# Altium schematic sheet ESP32.SchDoc
size A3 portrait
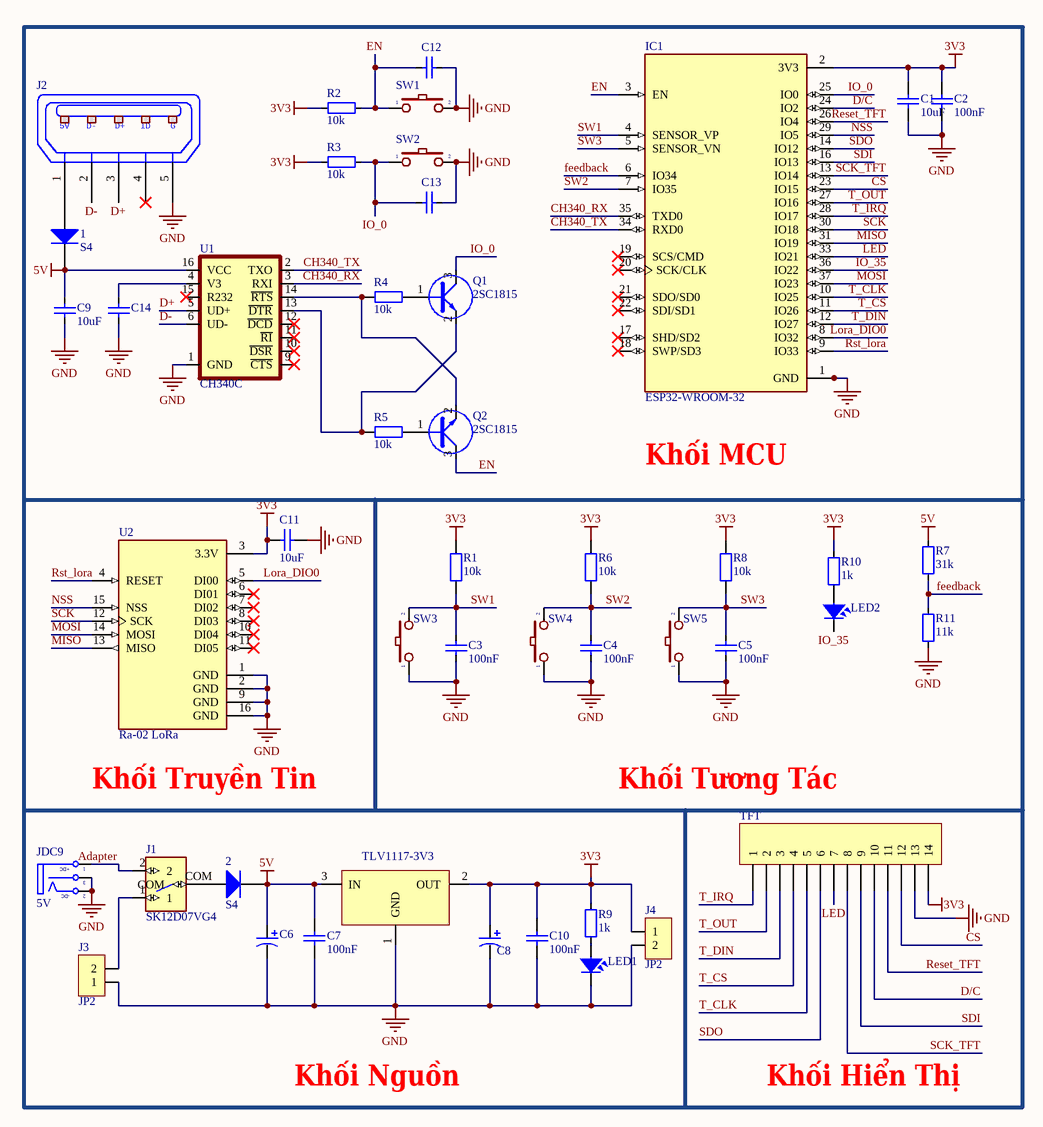
[diagram p0: ESP32.SchDoc]

## Parts
1  S4  [DIO-214AC(SMA)]
2  S4  [DIO-214AC(SMA)]
C1  10uF  [CAP_0805]
C2  100nF  [CAP_0805]
C3  100nF  [CAP_0805]
C4  100nF  [CAP_0805]
C5  100nF  [CAP_0805]
C6  22uF/10V  [CAP_7343]  (value not drawn)
C7  100nF  [CAP_0805]
C8  22uF/10V  [CAP_7343]  (value not drawn)
C9  10uF  [CAP_0805]
C10  100nF  [CAP_0805]
C11  10uF  [CAP_0805]
C12  100nF  [CAP_0805]  (value not drawn)
C13  100nF  [CAP_0805]  (value not drawn)
C14  100nF  [CAP_0805]  (value not drawn)
IC1  ESP32-WROOM-32  [MODULE_ESP32-WROOM-32]
J1  SK12D07VG4  [SK12D07VG4]
J2  USB-5  [USB-M1]  (value not drawn)
J3  JP2  [JP2-C1T]
J4  JP2  [JP2-C1T]
JDC9  5V  [DC-IN]
LED1  LED  [LED-0805-Blue]  (value not drawn)
LED2  LED  [LED-0805-Blue]  (value not drawn)
Power1  TLV1117-3V3  [SOT230P700X180-4N]
Q1  2SC1815  [SOT23D]
Q2  2SC1815  [SOT23D]
R1  10k  [RES_SMD_0805]
R2  10k  [RES-SMD-0805]
R3  10k  [RES-SMD-0805]
R4  10k  [RES-SMD-0805]
R5  10k  [RES-SMD-0805]
R6  10k  [RES_SMD_0805]
R7  31k  [RES-SMD-0805]
R8  10k  [RES_SMD_0805]
R9  1k  [RES-SMD-0805]
R10  1k  [RES-SMD-0805]
R11  11k  [RES-SMD-0805]
SW1  SW  [SW 3x2x4]  (value not drawn)
SW2  SW  [SW 3x2x4]  (value not drawn)
SW3  SW  [SW-SMD]  (value not drawn)
SW4  SW  [SW-SMD]  (value not drawn)
SW5  SW  [SW-SMD]  (value not drawn)
TFT  JP14  [JP14-D1T]  (value not drawn)
U1  CH340C  [SOP-16]
U2  Ra-02 LoRa  [Ra-02]

## Nets
3V3: C1.1 C2.1 C8.1 C10.1 C11.1 IC1.2(3V3) J4.1 Power1.2(OUT) R1.1 R2.2 R3.2 R6.1 R8.1 R9.1 R10.1 TFT.14 U2.3(3.3V)
5V: 1.2(K) 2.2(K) C6.1 C7.1 C9.2 Power1.3(IN) R7.1 U1.16(VCC)
GND: C1.2 C2.2 C3.2 C4.2 C5.2 C6.2 C7.2 C8.2 C9.1 C10.2 C11.2 C12.2 C13.2 C14.2 IC1.1(GND) IC1.15(GND) IC1.38(GND) IC1.39_1(GND) IC1.39_2(GND) IC1.39_3(GND) IC1.39_4(GND) IC1.39_5(GND) IC1.39_6(GND) IC1.39_7(GND) IC1.39_8(GND) IC1.39_9(GND) IC1.39_10(GND) IC1.39_11(GND) IC1.39_12(GND) IC1.39_13(GND) IC1.39_14(GND) IC1.39_15(GND) IC1.39_16(GND) IC1.39_17(GND) IC1.39_18(GND) IC1.39_19(GND) IC1.39_20(GND) IC1.39_21(GND) J2.5(P5) J3.1 J4.2 JDC9.2(TN) JDC9.3(S) LED1.2 Power1.1(GND) R11.2 SW1.2 SW2.2 SW3.1 SW4.1 SW5.1 TFT.13 U1.1(GND) U2.1(GND) U2.2(GND) U2.9(GND) U2.16(GND)
Adapter: J1.2 JDC9.1(T)
CH340_RX: IC1.35(TXD0) U1.3(RXI)
CH340_TX: IC1.34(RXD0) U1.2(TXO)
CS: IC1.23(IO15) TFT.12
D+: J2.3(P3) U1.5(UD+)
D-: J2.2(P2) U1.6(UD-)
D/C: IC1.24(IO2) TFT.10
EN: C12.1 IC1.3(EN) Q2.3(C) R2.1 SW1.1
feedback: IC1.6(IO34) R7.2 R11.1
IO_0: C13.1 IC1.25(IO0) Q1.3(C) R3.1 SW2.1
IO_35: IC1.36(IO22) LED2.2
LED: IC1.33(IO21) TFT.7
Lora_DIO0: IC1.8(IO32) U2.5(DI00)
MISO: IC1.31(IO19) U2.13(MISO)
MOSI: IC1.37(IO23) U2.14(MOSI)
NSS: IC1.29(IO5) U2.15(NSS)
Reset_TFT: IC1.26(IO4) TFT.11
Rst_lora: IC1.9(IO33) U2.4(RESET)
SCK: IC1.30(IO18) U2.12(SCK)
SCK_TFT: IC1.13(IO14) TFT.8
SDI: IC1.16(IO13) TFT.9
SDO: IC1.14(IO12) TFT.6
SW1: C3.1 IC1.4(SENSOR_VP) R1.2 SW3.2
SW2: C4.1 IC1.7(IO35) R6.2 SW4.2
SW3: C5.1 IC1.5(SENSOR_VN) R8.2 SW5.2
T_CLK: IC1.10(IO25) TFT.5
T_CS: IC1.11(IO26) TFT.4
T_DIN: IC1.12(IO27) TFT.3
T_IRQ: IC1.28(IO17) TFT.1
T_OUT: IC1.27(IO16) TFT.2
Net1_1: 1.1(A) J2.1(P1)
Net2_1: 2.1(A) J1.COM
NetC14_1: C14.1 U1.4(V3)
NetJ1_1: J1.1 J3.2
NetLED1_1: LED1.1 R9.2
NetLED2_1: LED2.1 R10.2
NetQ1_1: Q1.1(B) R4.1
NetQ1_2: Q1.2(E) R5.2 U1.13(~{DTR})
NetQ2_1: Q2.1(B) R5.1
NetQ2_2: Q2.2(E) R4.2 U1.14(~{RTS})

Not connected (* = marked no-connect by the designer): IC1 17(SHD/SD2)* 18(SWP/SD3)* 19(SCS/CMD)* 20(SCK/CLK)* 21(SDO/SD0)* 22(SDI/SD1)*; J2 4(P4)*; U1 9(~{CTS})* 10(~{DSR})* 11(~{RI})* 12(~{DCD})* 15(R232)*; U2 6(DI01)* 7(DI02)* 8(DI03)* 10(DI04)* 11(DI05)*

## Notes on the sheet
- Khối MCU
- Khối Truyền Tin
- Khối Tương Tác
- Khối Nguồn
- Khối Hiển Thị
- (in symbol DCIN) +DC; -DC
- (in symbol USB-5) 5V; D-; D+; ID; G

## Library data of the parts
1 2 = Diode S4: Dán; Ten_Linh_Kien: Diode S4 SOD123 ( 1N5819 SOD123); Ma_Hang: MH005519; Don_Vi: Con; Ghi_Chu: *; Chung_Loai: Dán; Kieu_Chan: *
C1-C5 C7 C9-C14 = CapSMD: Capacitor; Value: 33p; Published: 8-Jun-2000; LatestRevisionDate: 17-Jul-2002; LatestRevisionNote: Re-released for DXP Platform.; PackageReference: RAD-0.3; Publisher: Altium Limited
C6 C8 = CAP_TAN_SMD: Polazied Tantalum Capacitor
IC1 = ESP32-WROOM-32: Bluetooth, WiFi Transceiver Module 2.4GHz ~ 2.5GHz Surface Mount; MF: Espressif Systems; Package: Module Espressif Systems; Digi-Key_Part_Number: 1904-1010-1-ND; Digi-Key_Purchase_URL: https://www.digikey.com/product-detail/en/espressif-systems/ESP32-WROOM-32/1904-1010-1-ND/8544305?utm_source=snapeda&utm_medium=aggregator&utm_campaign=symbol; Value: *; MP: ESP32-WROOM-32; SnapEDA_Link: https://www.snapeda.com/parts/ESP32-WROOM-32/Espressif%20Systems/view-part/2753322/?ref=snap
J1 = SK12D07VG4: Switch Slide ON ON SPDT Side Slide 0.3A 30VDC PC Pins Bracket Mount/Through Hole Bulk; MF: C&K; Price: None; Check_prices: https://www.snapeda.com/parts/SK12D07VG4/C&K/view-part/6618061/?ref=eda; SnapEDA_Link: https://www.snapeda.com/parts/SK12D07VG4/C&K/view-part/6618061/?ref=snap; Package: None; Availability: Not in stock; MP: SK12D07VG4; Value: *
J2 = USB-5: Manufacturer: FCI; Manufacturer Part Number: 10118193-0001LF; Connector Type: USB - micro B; Number of Contacts: 5; Gender: Receptacle; Specifications: USB 2.0; .Creator: MM; .Checked PCB: RF; Supplier 1: Digi-Key; RoHS: RoHS Compliant; Category: Connectors, Interconnects; Stock 1: 28642; Pricing 1: 1=0.46, 10=0.433, 25=0.3712, 50=0.3156, 100=0.3032, 250=0.27224, 500=0.25988 (USD); Packaging: Cut Tape (CT); Mounting Type: Surface Mount, Right Angle, Horizontal; Features: Shielded, Solder Retention; Ingress Protection: -; ComponentLink1URL: http://portal.fciconnect.com/Comergent//fci/drawing/10118193.pdf; ComponentLink1Description: http://portal.fciconnect.com/Comergent//fci/drawing/10118193.pdf; Supplier Part Number 1: 609-4616-1-ND; .Checked SCH: MM
J3 J4 = JP2: WR-PHD 2.54 mm Angled Socket Header; Manufacturer: W¨¹rth Elektronik eiSos GmbH; partNo: 613002143121; ComponentLink1 Description: Manufacturer; ComponentLink2 Description: Datasheet; NoPins: 02; Created Date: 29 March 2013; ComponentLink1URL: http://www.we-online.com; ComponentLink2URL: http://katalog.we-online.de/em/datasheet/6130xx143121.pdf; Created by: Karrer Zheng
JDC9 = DCIN: Jac DC input; Value: Jac DC
LED1 LED2 = LED: LED Single colour Green and Red; Value: LED 3 ly Single Colour
Power1 = LM1117: 800mA Low-Dropout Linear Regulator; Creator: Nguyen Ba Bien; Website: http://group3i.net
Q1 Q2 = C1815: NPN 600mW, ECB; Value: C1815
R1 R4-R6 R8 = Resistor - SMD: Resistor SMD; Manufacturer: Generic Components; Class: Passive; Published: 08/06/2000; Publisher: Altium Hobart Technology Centre
R2 R3 R7 R9-R11 = Resistor - SMD: Resistor; Manufacturer: Generic Components; Class: Passive; Published: 08/06/2000; Publisher: Altium Hobart Technology Centre
SW1-SW5 = SW2: Switch button 2 pin; Value: SW chip 2 pin
TFT = JP14: WR-PHD 2.54 mm Angled Socket Header; Manufacturer: W¨¹rth Elektronik eiSos GmbH; partNo: 613014143121; ComponentLink1 Description: Manufacturer; ComponentLink2 Description: Datasheet; NoPins: 14; Created Date: 29 March 2013; ComponentLink1URL: http://www.we-online.com; ComponentLink2URL: http://katalog.we-online.de/em/datasheet/6130xx143121.pdf; Created by: Karrer Zheng
U1 = CH340C: USB to serial chip CH340; MF: WCH; Package: Package; Check_prices: https://www.snapeda.com/parts/CH340C/WCH/view-part/5428851/?ref=eda; Value: *; Price: None; MP: CH340C; Availability: Unavailable; SnapEDA_Link: https://www.snapeda.com/parts/CH340C/WCH/view-part/5428851/?ref=snap
U2 = Ra-02 LoRa: LoRa Module Ra-02